# EAGLE design TriggerTrap Shield 0v24 Release (EAGLE 6.2)
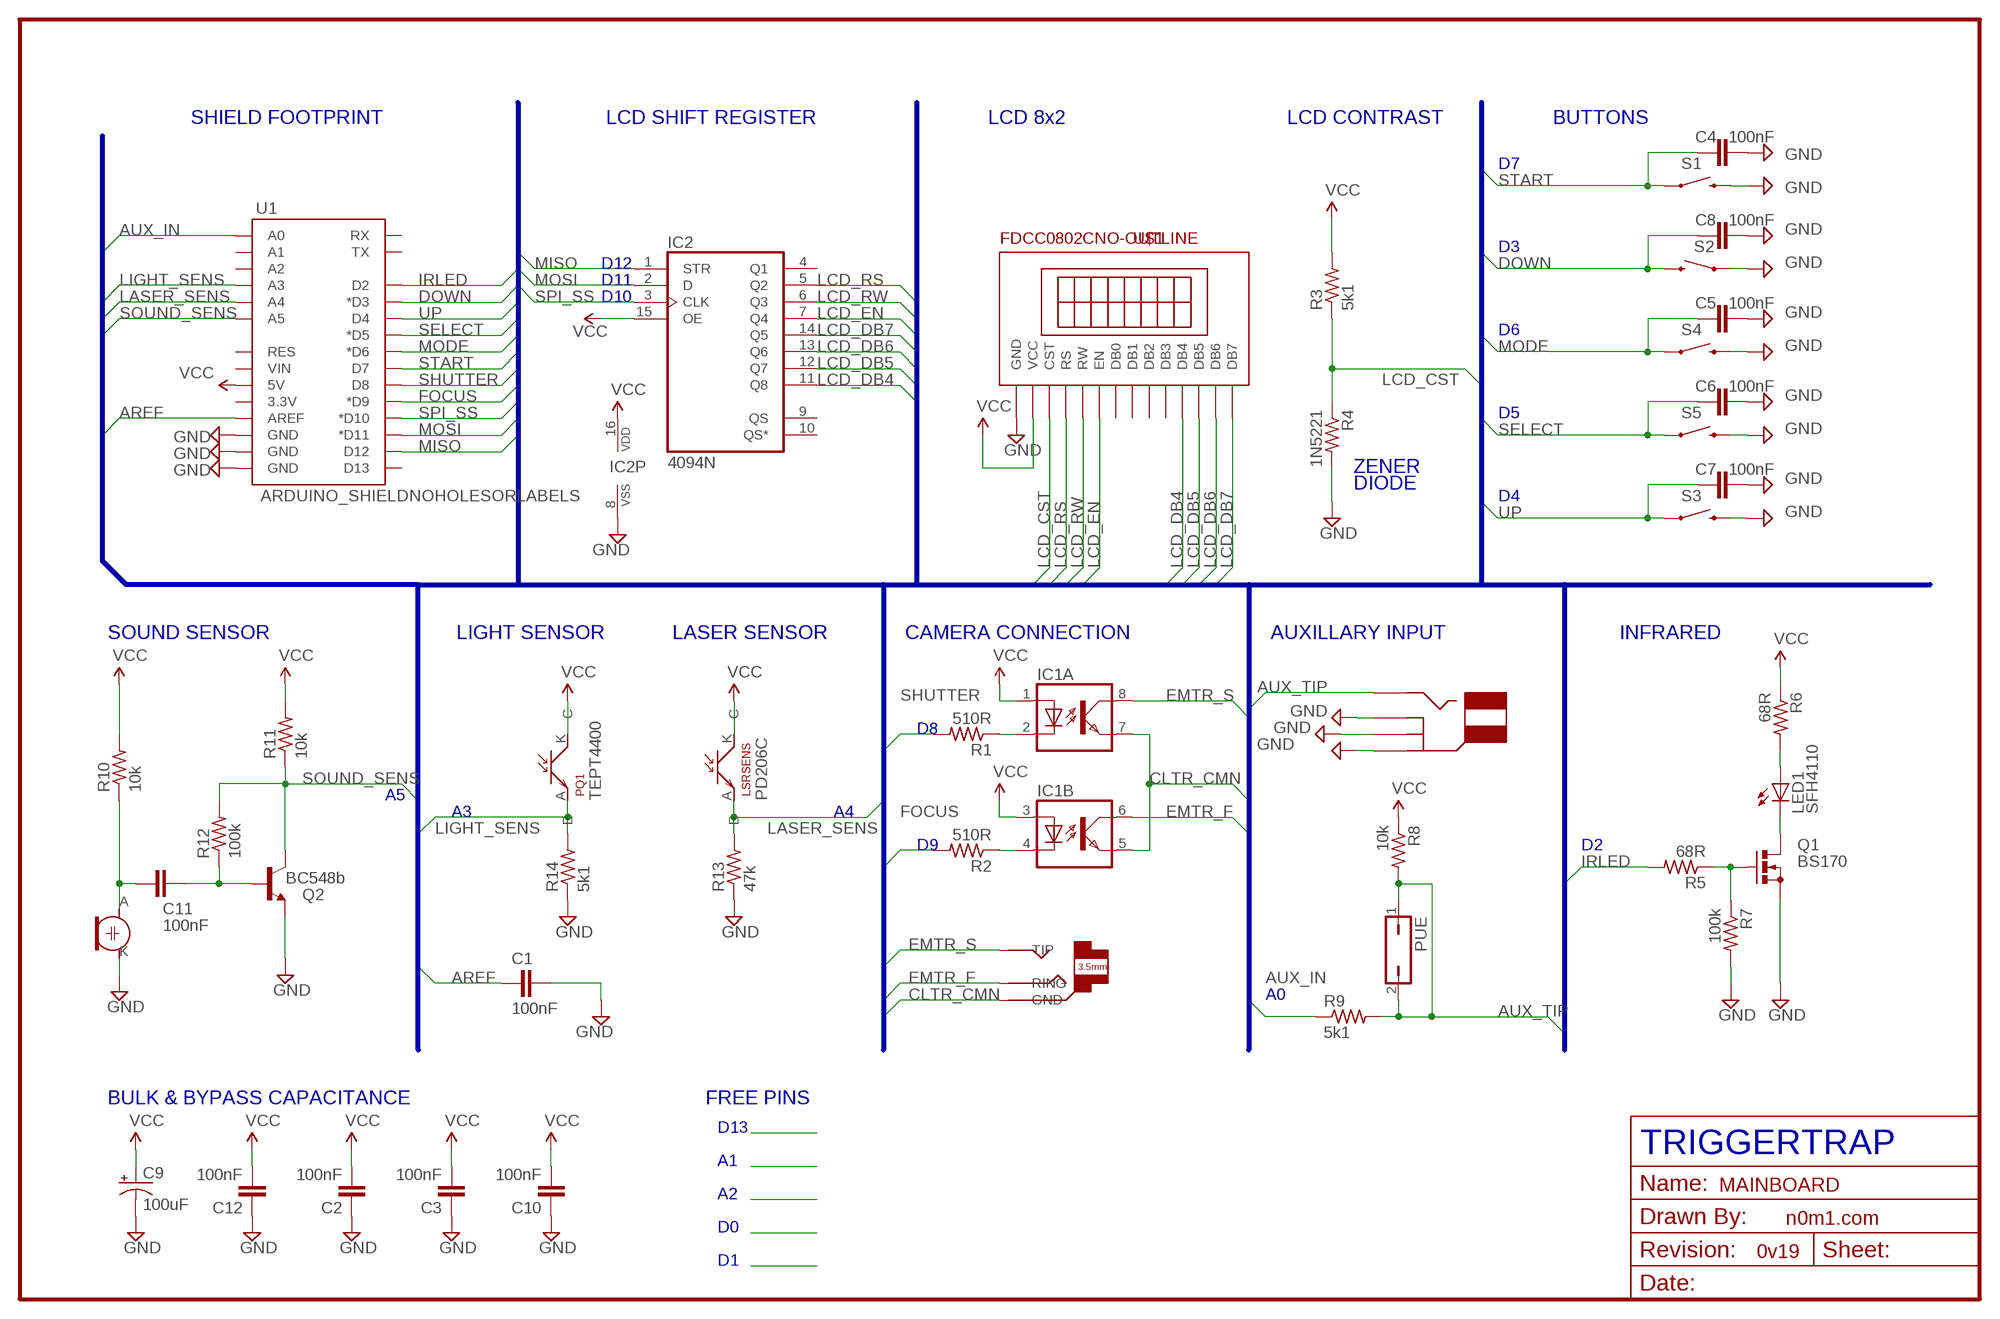
[diagram p0: schematic, sheet 1]

## Parts
AUX  CUI_RCJ-017-RCA  [RCA_CUI_RCJ-017]
C1  100nF  C-EU050-024X044  [C050-024X044]
C2  100nF  C-EU050-024X044  [C050-024X044]
C3  100nF  C-EU050-024X044  [C050-024X044]
C4  100nF  C-EU050-024X044  [C050-024X044]
C5  100nF  C-EU050-024X044  [C050-024X044]
C6  100nF  C-EU050-024X044  [C050-024X044]
C7  100nF  C-EU050-024X044  [C050-024X044]
C8  100nF  C-EU050-024X044  [C050-024X044]
C9  100uF  CPOL-USTT2D7L  [TT2D7L]
C10  100nF  C-EU050-024X044  [C050-024X044]
C11  100nF  C-EU050-024X044  [C050-024X044]
C12  100nF  C-EU050-024X044  [C050-024X044]
CAM  AUDIO_3.5MM_L_3523  [AUDIO_3.5MM_LONG]
IC1  LTV826SMLPADS  [DIL08-SMLPADS]
IC2  4094N  [DIL16]
LED1  SFH4110  LEDSIDE_LED  [SIDE_LED]
LSRSENS  PD204-6C  LASER_SNS3MM  [LSR-SNS-3MM]
MIC  MIC  [MIC-254-ECM94-RO]
PQ1  TEPT4400  AMB-LIGHT-SENS  [LED-3MM]
PUE  JP1Q  [JP1]
Q1  BS170  [SOT54E]
Q2  BC548b  BC55054  [SOT54E]
R1  510R  R-US_0204/5  [0204/5]
R2  510R  R-US_0204/5  [0204/5]
R3  5k1  R-US_0204/5  [0204/5]
R4  1N5221  R-US_0204/5  [0204/5]
R5  68R  R-US_0204/5  [0204/5]
R6  68R  R-US_0204/5  [0204/5]
R7  100k  R-US_0204/5  [0204/5]
R8  10k  R-US_0204/5  [0204/5]
R9  5k1  R-US_0204/5  [0204/5]
R10  10k  R-US_0204/5  [0204/5]
R11  10k  R-US_0204/5  [0204/5]
R12  100k  R-US_0204/5  [0204/5]
R13  47k  R-US_0204/5  [0204/5]
R14  5k1  R-US_0204/5  [0204/5]
S1  SWITCH-MOMENTARY-212MM  [TACTILE-PTH-12MM]
S2  SWITCH-MOMENTARY-2PTH  [TACTILE-PTH]
S3  SWITCH-MOMENTARY-2PTH  [TACTILE-PTH]
S4  SWITCH-MOMENTARY-2PTH  [TACTILE-PTH]
S5  SWITCH-MOMENTARY-2PTH  [TACTILE-PTH]
U1  ARDUINO_SHIELDNOHOLESORLABELS  [DUEMILANOVE_SHIELD_NOHOLES_NOLABELS]
U$1  FDCC0802CNO-OUTLINE  [8X2-TOPLCD-NOOUTLINE]

## Nets
AREF: C1.2 U1.AREF
AUX_IN: R9.1 U1.A0
AUX_TIP: AUX.P$4(TIP) PUE.1 PUE.2 R8.2 R9.2
CLTR_CMN: CAM.P$1(GND) IC1.5(B:EMIT) IC1.7(A:EMIT)
DOWN: C8.1 S2.3 U1.D3(*D3)
EMTR_F: CAM.P$3(RING) IC1.6(B:COL)
EMTR_S: CAM.P$2(TIP) IC1.8(A:COL)
FOCUS: R2.2 U1.D9(*D9)
GND: AUX.P$1(GND1) AUX.P$2(GND2) AUX.P$3(GND) C1.1 C2.1 C3.1 C4.2 C5.2 C6.2 C7.2 C8.2 C9.- C10.1 C12.1 IC2.8(VSS) MIC.K Q1.S Q2.S(E) R4.2 R7.2 R13.1 R14.1 S1.3 S2.1 S3.3 S4.3 S5.3 U1.GND@0(GND) U1.GND@1(GND) U1.GND@2(GND) U$1.P$1(GND)
IRLED: R5.2 U1.D2
LASER_SENS: LSRSENS.A(E) R13.2 U1.A4
LCD_CST: R3.1 R4.1 U$1.P$3(CST)
LCD_DB4: IC2.11(Q8) U$1.P$11(DB4)
LCD_DB5: IC2.12(Q7) U$1.P$12(DB5)
LCD_DB6: IC2.13(Q6) U$1.P$13(DB6)
LCD_DB7: IC2.14(Q5) U$1.P$14(DB7)
LCD_EN: IC2.7(Q4) U$1.P$6(EN)
LCD_RS: IC2.5(Q2) U$1.P$4(RS)
LCD_RW: IC2.6(Q3) U$1.P$5(RW)
LIGHT_SENS: PQ1.A(E) R14.2 U1.A3
MISO: IC2.1(STR) U1.D12
MODE: C5.1 S4.1 U1.D6(*D6)
MOSI: IC2.2(D) U1.D11(*D11)
N$1: C11.1 MIC.A R10.1
N$2: LED1.K(C) Q1.D
N$4: LED1.A R6.2
N$7: Q1.G R5.1 R7.1
N$10: C11.2 Q2.G(B) R12.1
N$11: IC1.4(B:C) R2.1
N$13: IC1.2(A:C) R1.1
SELECT: C6.1 S5.1 U1.D5(*D5)
SHUTTER: R1.2 U1.D8
SOUND_SENS: Q2.D(C) R11.1 R12.2 U1.A5
SPI_SS: IC2.3(CLK) U1.D10(*D10)
START: C4.1 S1.1 U1.D7
UP: C7.1 S3.1 U1.D4
VCC: C2.2 C3.2 C9.+ C10.2 C12.2 IC1.1(A:A) IC1.3(B:A) IC2.15(OE) IC2.16(VDD) LSRSENS.K(C) PQ1.K(C) R3.2 R6.1 R8.1 R10.2 R11.2 U1.5V U$1.P$2(VCC)
Unconnected: IC2.4(Q1) IC2.9(QS) IC2.10(QS*) U1.3.3V U1.A1 U1.A2 U1.D13 U1.RES U1.RX U1.TX U1.VIN U$1.P$7(DB0) U$1.P$8(DB1) U$1.P$9(DB2) U$1.P$10(DB3)

## Buses
B$1

## Notes on the sheet
- SHIELD FOOTPRINT | LCD SHIFT REGISTER | LCD 8x2 | LCD CONTRAST | BUTTONS
- D7
- D3
- D12
- D11
- D10
- D6
- D5
- ZENER
- DIODE
- D4
- SOUND SENSOR | LIGHT SENSOR | LASER SENSOR | CAMERA CONNECTION | AUXILLARY INPUT | INFRARED
- D8
- A5 | TEPT4400 | PD206C
- A3 | A4
- D9 | D2
- A0
- BULK & BYPASS CAPACITANCE | FREE PINS
- D13
- TRIGGERTRAP
- A1
- MAINBOARD
- A2
- n0m1.com
- D0
- 0v19
- D1

## Library data of the parts
AUX = TriggerTrap:CUI_RCJ-017-RCA
C1-C8 C10-C12 = rcl:C-EU: CAPACITOR, European symbol
C9 = rcl:CPOL-US: POLARIZED CAPACITOR, American symbol
CAM = TriggerTrap:AUDIO_3.5MM_L_3523
IC1 = optocoupler:LTV826: OPTO COUPLER Source: LITEON, LTV816.pdf
IC2 = 40xx:4094: 8-stage SHIFT/STORE REGISTER, tri-state
LED1 = led:LED: LED OSRAM: - CHIPLED LG R971, LG N971, LY N971, LG Q971, LY Q971, LO R971, LY R971 LH N974, LH R974 LS Q976, LO Q976, LY Q976 LO Q996 - Hyper CHIPLED LW Q18S LB Q993, LB Q99A, LB R99A - SideLED LS A670, LO A670, LY A670, LG A670, LP A670 LB A673, LV A673, LT A673, LW A673 LH A674 LY A675 LS A676, LA A676, LO A676, LY A676, LW A676 LS A679, LY A679, LG A679 - Hyper Micro SIDELED® LS Y876, LA Y876, LO Y876, LY Y876 LT Y87S - SmartLED LW L88C, LW L88S LB L89C, LB L89S, LG L890 LS L89K, LO L89K, LY L89K LS L896, LA L896, LO L896, LY L896 - TOPLED LS T670, LO T670, LY T670, LG T670, LP T670 LSG T670, LSP T670, LSY T670, LOP T670, LYG T670 LG T671, LOG T671, LSG T671 LB T673, LV T673, LT T673, LW T673 LH T674 LS T676, LA T676, LO T676, LY T676, LB T676, LH T676, LSB T676, LW T676 LB T67C, LV T67C, LT T67C, LS T67K, LO T67K, LY T67K, LW E67C LS E67B, LA E67B, LO E67B, LY E67B, LB E67C, LV E67C, LT E67C LW T67C LS T679, LY T679, LG T679 LS T770, LO T770, LY T770, LG T770, LP T770 LB T773, LV T773, LT T773, LW T773 LH T774 LS E675, LA E675, LY E675, LS T675 LS T776, LA T776, LO T776, LY T776, LB T776 LHGB T686 LT T68C, LB T68C - Hyper Mini TOPLED® LB M676 - Mini TOPLED Santana® LG M470 LS M47K, LO M47K, LY M47K Source: http://www.osram.convergy.de LUXEON: - LUMILED® LXK2-PW12-R00, LXK2-PW12-S00, LXK2-PW14-U00, LXK2-PW14-V00 LXK2-PM12-R00, LXK2-PM12-S00, LXK2-PM14-U00 LXK2-PE12-Q00, LXK2-PE12-R00, LXK2-PE12-S00, LXK2-PE14-T00, LXK2-PE14-U00 LXK2-PB12-K00, LXK2-PB12-L00, LXK2-PB12-M00, LXK2-PB14-N00, LXK2-PB14-P00, LXK2-PB14-Q00 LXK2-PR12-L00, LXK2-PR12-M00, LXK2-PR14-Q00, LXK2-PR14-R00 LXK2-PD12-Q00, LXK2-PD12-R00, LXK2-PD12-S00 LXK2-PH12-R00, LXK2-PH12-S00 LXK2-PL12-P00, LXK2-PL12-Q00, LXK2-PL12-R00 Source: www.luxeon.com KINGBRIGHT: KA-3528ASYC Source: www.kingbright.com
LSRSENS = TriggerTrap:LASER_SNS
MIC = TriggerTrap:MIC
PQ1 = TriggerTrap:AMB-LIGHT-SENS
PUE = jumper:JP1Q: JUMPER
Q1 = transistor-small-signal:BS170: N-CHANNEL MOS FET
Q2 = transistor-npn:BC550*: NPN Transistor
R1-R14 = rcl:R-US_: RESISTOR, American symbol
S1-S5 = SparkFun:SWITCH-MOMENTARY-2
U1 = SparkFun:ARDUINO_SHIELD
U$1 = TriggerTrap:FDCC0802C

## Net classes
0 default: width 0.152 mm, drill 0.3 mm, clearance 0.152 mm
1 power: width 0.254 mm, drill 0.3 mm, clearance 0.152 mm

## Board
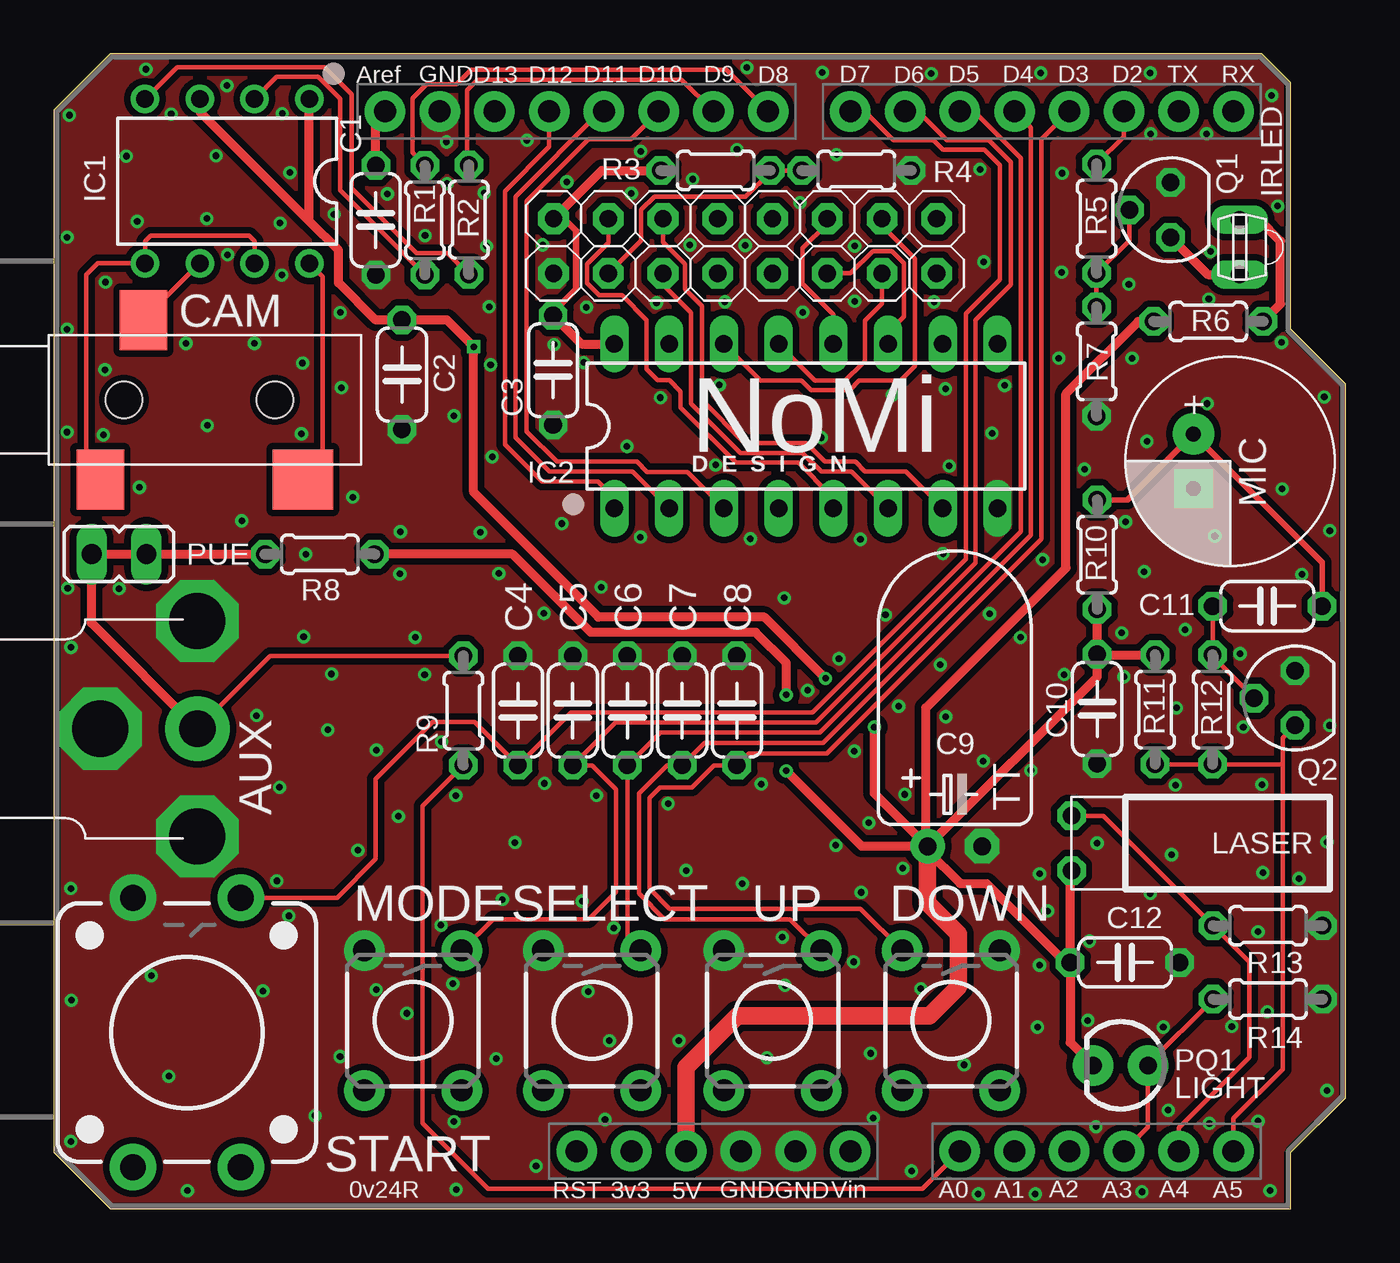
[diagram p1: board, top side]
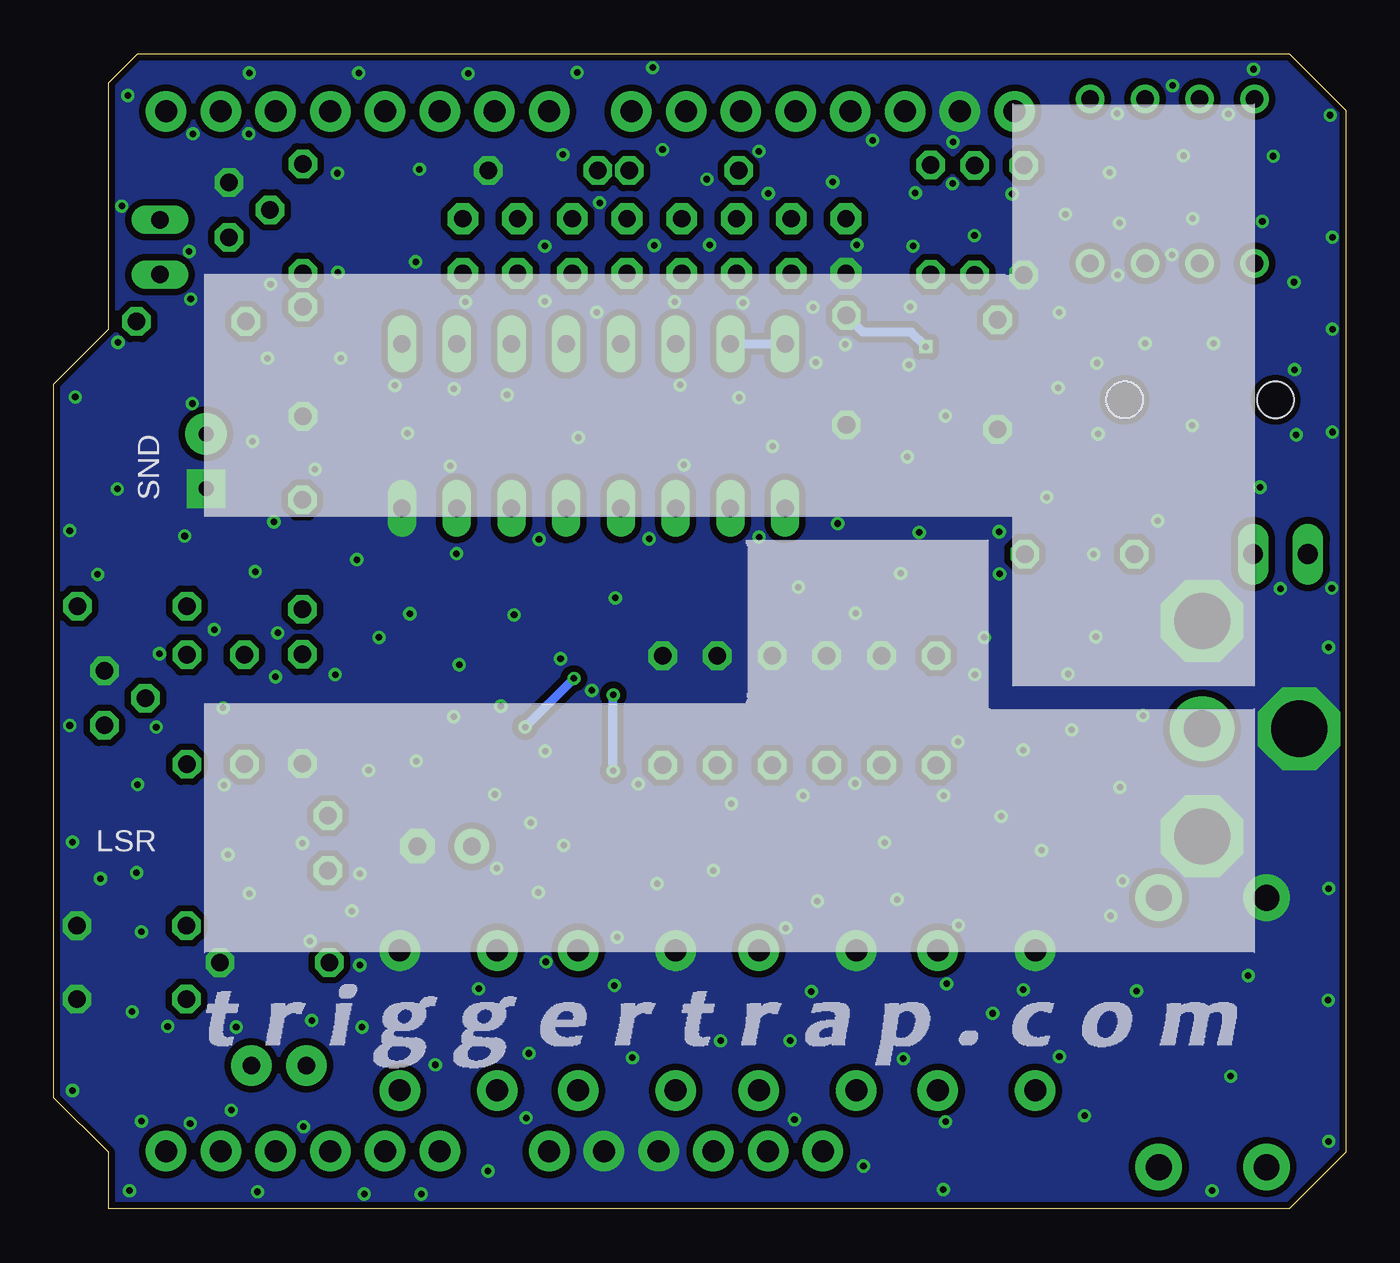
[diagram p2: board, bottom side, seen from below]

Size 59.94 x 53.59 mm. Coordinates in mm from the lower left corner, seen from the top.
Outline: 57.4,0 57.4,2.62 59.94,5.16 59.94,38.28 57.4,40.82 57.4,52.25 56.06,53.59 2.62,53.59 0,50.98 0,2.62 2.62,0 57.4,0
Copper layers (1*16): Top 0.035mm / dielectric 1.5mm / Bottom 0.035mm
Design rules: minimum track width 6mil, minimum drill 0.3mm, track to track 8mil, track to pad 6mil, pad to pad 6mil, via to via 8mil, smd to smd 0mil, copper to edge 10mil, drill to drill 10mil, minimum pad ring 10mil, minimum via ring 6mil, stop-mask expansion 2mil, vias tented up to drill 100mil, thermal gap 10mil

### Footprints (pad centres in the part's own frame; a part is rotated, then mirrored left to right if it is on the bottom)
RCA_CUI_RCJ-017 = drill 2.6 pad 3.81 octagon: P$1 0,0; P$2 -5,-4.5; P$3 5,-4.5 | drill 1.7 pad 3: P$4 0,-4.5
C050-024X044 = drill 0.813 octagon: 1 -2.54,0; 2 2.54,0
TT2D7L = drill 0.813 pad 1.6: + -1.27,0 | drill 0.813 pad 1.6 octagon: - 1.27,0
AUDIO_3.5MM_LONG = smd 2.2 x 2.8: P$1 -4.6,-3.7; P$3 -2.6,3.7 | smd 2.8 x 2.8: P$2 4.8,-3.7 | hole 1.7: -3.5,0; 3.5,0
DIL08-SMLPADS = drill 0.813: 1 -3.81,-3.81; 2 -1.27,-3.81; 3 1.27,-3.81; 4 3.81,-3.81; 5 3.81,3.81; 6 1.27,3.81; 7 -1.27,3.81; 8 -3.81,3.81
DIL16 = drill 0.813 long: 1 -8.89,-3.81; 2 -6.35,-3.81; 3 -3.81,-3.81; 4 -1.27,-3.81; 5 1.27,-3.81; 6 3.81,-3.81; 7 6.35,-3.81; 8 8.89,-3.81; 9 8.89,3.81; 10 6.35,3.81; 11 3.81,3.81; 12 1.27,3.81; 13 -1.27,3.81; 14 -3.81,3.81; 15 -6.35,3.81; 16 -8.89,3.81
SIDE_LED = drill 0.813 long: A 1.27,0; K -1.27,0
LSR-SNS-3MM = drill 0.813 octagon: A -1.27,-7.62; K 1.27,-7.62
MIC-254-ECM94-RO = drill 0.7 pad 1.93: A 1.27,-1.7 | drill 0.7 pad 1.778 square: K -1.27,-1.7
LED-3MM = drill 0.813 pad 1.88: A -1.27,0; K 1.27,0
JP1 = drill 0.914 long: 1 0,-1.27; 2 0,1.27
SOT54E = drill 0.813 octagon: D -1.27,0; G 0,1.905; S 1.27,0
0204/5 = drill 0.813 octagon: 1 -2.54,0; 2 2.54,0
TACTILE-PTH-12MM = drill 1.2 pad 2.159: 1 6.25,-2.5; 2 -6.25,-2.5; 3 6.25,2.5; 4 -6.25,2.5
TACTILE-PTH = drill 1.016 pad 1.88: 1 -3.251,2.261; 2 3.251,2.261; 3 -3.251,-2.261; 4 3.251,-2.261
DUEMILANOVE_SHIELD_NOHOLES_NOLABELS = drill 1.016 pad 1.88: 3.3V 50.8,26.67; 5V 50.8,29.21; A0 50.8,41.91; A1 50.8,44.45; A2 50.8,46.99; A3 50.8,49.53; A4 50.8,52.07; A5 50.8,54.61; AREF 2.54,15.24; D2 2.54,49.53; D3 2.54,46.99; D4 2.54,44.45; D5 2.54,41.91; D6 2.54,39.37; D7 2.54,36.83; D8 2.54,33.02; D9 2.54,30.48; D10 2.54,27.94; D11 2.54,25.4; D12 2.54,22.86; D13 2.54,20.32; GND@0 50.8,31.75; GND@1 50.8,34.29; GND@2 2.54,17.78; RES 50.8,24.13; RX 2.54,54.61; TX 2.54,52.07; VIN 50.8,36.83
8X2-TOPLCD-NOOUTLINE = drill 0.8 pad 1.422 octagon: P$1 -7.62,-1.27; P$2 -7.62,1.27; P$3 -5.08,-1.27; P$4 -5.08,1.27; P$5 -2.54,-1.27; P$6 -2.54,1.27; P$7 0,-1.27; P$8 0,1.27; P$9 2.54,-1.27; P$10 2.54,1.27; P$11 5.08,-1.27; P$12 5.08,1.27; P$13 7.62,-1.27; P$14 7.62,1.27; P$15 10.16,-1.27; P$16 10.16,1.27

### Placement (x,y rotation side)
AUX  2.16,22.28 90 top
C1  14.94,45.87 90 top
C2  16.15,38.71 90 top
C3  23.16,38.91 90 top
C4  21.54,23.11 90 top
C5  24.08,23.11 90 top
C6  26.62,23.11 90 top
C7  29.16,23.11 90 top
C8  31.7,23.11 90 top
C9  41.81,16.81 0 top
C10  48.41,23.19 90 top
C11  56.31,27.97 180 top
C12  49.71,11.43 180 top
CAM  6.76,37.54 0 top
IC1  8.04,47.69 180 top
IC2  34.9,36.32 0 top
LED1  55.03,44.62 90 top
LSRSENS  54.84,16.97 270 top
MIC  54.58,34.69 90 bottom
PQ1  49.5,6.65 180 top
PUE  3.02,30.38 90 top
Q1  51.82,46.36 90 top
Q2  57.61,23.7 90 top
R1  17.22,45.87 90 top
R2  19.25,45.9 90 top
R3  30.71,48.18 180 top
R4  37.24,48.18 0 top
R5  48.39,45.95 90 top
R6  53.57,41.17 0 top
R7  48.39,39.32 270 top
R8  12.34,30.38 180 top
R9  19,23.11 90 top
R10  48.41,30.35 270 top
R11  51.1,23.16 90 top
R12  53.77,23.16 270 top
R13  56.34,13.13 180 top
R14  56.34,9.73 180 top
S1  6.17,8.18 90 top
S2  41.63,8.74 270 top
S3  33.35,8.74 270 top
S4  16.66,8.74 270 top
S5  24.97,8.74 270 top
U1  0.13,53.47 270 top
U$1  30.81,44.68 0 top

### Tracks (layer width: path | path; a pad name or v marks a point on that pad's centre or on a via)
AREF
  Top 0.406: C1.2 14.94,50.5 U1.AREF
AUX_IN
  Top 0.203: U1.A0 40.31,0.94 20.15,0.94 17.12,3.96 17.12,18.69 R9.1
AUX_TIP
  Top 0.203: R9.2 10.04,25.65 AUX.P$4
  Top 0.406: AUX.P$4 1.75,27.18 1.75,30.25 | R8.2 PUE.1 1.88,30.38 1.75,30.25 | 1.75,30.25 PUE.2
CLTR_CMN
  Top 0.203: IC1.7 9.32,43.88 9.32,44.91 9.07,45.16 4.49,45.16 4.23,44.91 IC1.5 2.04,43.88 1.5,43.34 1.5,34.63 1.51,34.47 | CAM.P$1 1.51,34.47 | 1.51,34.47 1.42,34.58
DOWN
  Top 0.203: U1.D3 45.82,49.63 45.82,31.08 35.88,21.13 32.26,21.13 C8.1 31.5,20.57 31.37,20.57 30.63,20.57 29.62,19.56 28.14,19.56 27.64,19.05 27.64,14.86 28.57,13.92 37.44,13.92 S2.3
EMTR_F
  Top 0.203: CAM.P$3 4.16,41.26 IC1.6
EMTR_S
  Top 0.203: IC1.8 12.47,43.26 12.47,33.71 12.46,33.71 CAM.P$2
FOCUS
  Top 0.203: U1.D9 29.13,52.4 19.66,52.4 19.18,51.92 19.18,48.51 R2.2
GND  (via drill 0.3)
  other vias: 41.38,38.05 10.6,50.83 16.08,31.42 18.57,36.8 11.69,30.37 11.48,35.96 13.29,41.59 23.57,31.8 8.03,52.12 5.44,50.8 0.72,50.75 0.62,45.09 3.87,45.82 7.09,45.95 10.5,45.75 10.95,48.08 7.53,48.87 17.23,45.16 18.22,49.5 21.95,49.58 19.97,47.14 20.07,44.68 20.2,41.86 10.57,43.33 9.3,40.16 6.13,40.16 0.62,40.82 2.37,38.94 2.29,35.92 13.34,38.1 7.12,36.35 8.72,31.93 3.97,33.48 14.1,16.64 0.79,26.06 12.88,24.82 14.97,21.29 9.41,22.89 3.03,28.78 12.71,22.23 11.59,26.54 16.77,26.52 17.2,24.79 15.98,18.21 10.34,15.21 10.47,19.56 41.26,30.4 37.43,31.06 32.32,31.09 27.22,31.17 13,46.15 41.14,25.25 37.15,21.23 41.39,22.83 46.11,13.82 36.29,16.87 29.34,15.7 37.46,14.68 16.38,9.07 20.52,6.96 25.78,7.8 29.01,7.8 33.1,7.01 37.9,7.21 40.23,10.21 37.11,11.46 18.52,10.44 14.96,10.16 13.28,7.06 18.57,4.04 22.38,1.98 25.58,4.14 18.67,0.89 0.79,14.86 0.81,9.68 0.79,3.12 6.2,0.84 4.52,10.82 5.33,6.15 9.7,10.11 12.12,4.32 10.9,13.59 38.02,4.22 39.8,1.75 42.9,0.69 42.24,6.68 45.54,0.69 50.5,0.79 56.44,0.84 55.88,4.06 53.62,3.96 51.71,4.57 56.31,9.14 54.66,8.46 51.49,8.43 59.08,5.49 57.78,15.32 59.08,17.02 59.21,22.43 56.06,19.69 56.11,15.6 55.88,12.85 51.87,16.43 52.04,19.66 48.41,16.97 48.06,12.42 50.88,14.63 46.89,24.79 45.34,20.35 43.13,20.78 45.75,15.54 52.1,23.24 55.19,22.35 55.04,25.76 52.5,26.87 57.91,29.44 49.73,31.88 44.86,26.52 53.87,31.22 58.95,37.67 57,33.4 53.52,37.36 50.04,39.47 47.83,34.32 50.72,35.61 56.97,40.21 53.67,44.42 49.89,42.9 46.76,43.46 46.79,48.06 50.9,49.89 53.49,49.89 56.52,51.66 50.88,52.7 45.8,52.7 40.72,52.68 35.66,52.73 42.98,48.23 40.84,42.09 43.15,43.94 37.16,44.68 36.32,48.92 34.75,41.61 31.14,42.09 29.51,44.73 32.08,44.7 34.62,46.69 31.7,49.15 29.64,47.78 23.8,47.65 27.23,49.07 26.8,47.12 24.71,41.83 27.97,42.04 22.68,44.73 23.22,40.11 28.14,37.64 26.59,35.38 30.71,34.52 30.89,38.23 35.61,35.79 38.91,37.77 41.55,34.47 44.12,38.2 43.54,35.99 17.96,13.16 24.52,14.27 39.49,19.23 19.79,31.39 37.16,42.11 2.39,43 8.06,44.27 39.21,23.32 46.63,39.47 45.89,30.12 43.42,27.61 49.56,26.72 11.54,39.24 20.81,14.35 25.18,19.18 25.98,13.03 24.79,10.08 33.81,12.6 31.95,15.09 33.93,10.36 39.4,15.8 45.75,11.3 45.64,8.43 48.36,3.81 24.59,39.27 20.27,39.16 20.34,34.9 20.65,29.49 32.16,52.96 53.59,42.21 56.79,46.53 47.98,8.74 22.77,19.74 18.65,19.18 21.39,16.99 28.51,18.8 32.82,19.71 17.99,21.67 34.98,24.05 38.59,27.56 33.89,28.35 22.74,27.64 36.43,25.53 25.4,28.85 13.87,33.02 49.66,24.69 37.82,17.91 4.27,52.88 3.36,48.84 15.48,47.09 16.05,29.46 0.62,36.04 0.64,28.8 50.6,29.57 59.21,31.47 18.24,47.57
  pour Top (isolate 0.305, no thermals): 0.13,50.93 0.13,2.67 2.67,0.13 57.28,0.13 57.28,2.67 59.82,5.21 59.82,38.23 57.28,40.77 57.28,52.2 56.01,53.47 2.67,53.47
  pour Bottom (isolate 0.305, no thermals): 0.13,50.93 0.13,2.67 2.67,0.13 57.28,0.13 57.28,2.67 59.82,5.21 59.82,38.23 57.28,40.77 57.28,52.2 56.01,53.47 2.67,53.47
IRLED
  Top 0.203: U1.D2 49.66,49.76 R5.2
LASER_SENS
  Top 0.203: U1.A4 52.2,3.76 55.47,7.04 55.47,11.46 R13.2 48.69,18.24 LSRSENS.A
LCD_CST
  Top 0.203: R4.1 R3.1 33.25,48.11 32.11,46.96 27.86,46.96 27.25,46.35 27.25,44.93 U$1.P$3
LCD_DB4
  Top 0.203: U$1.P$11 36.96,43.41 38,44.45 38.89,44.45 39.45,43.89 39.45,41.4 38.71,40.67 IC2.11
LCD_DB5
  Top 0.203: U$1.P$12 35.89,45.72 34.75,44.58 34.75,42.93 36.17,41.5 IC2.12
LCD_DB6
  Top 0.203: IC2.13 35.33,38.43 36.72,38.43 37.52,39.23 37.64,39.34 37.64,41.22 38.43,42.01 U$1.P$13
LCD_DB7
  Top 0.203: U$1.P$14 38.43,45.62 39.95,44.09 39.95,39.1 39.29,38.43 37.36,38.43 36.93,38 35.13,38 34.7,38.43 32.79,38.43 IC2.14
LCD_EN
  Top 0.203: IC2.7 39.55,34.21 37.64,34.21 37.19,34.67 35.79,34.67 34.92,35.53 32.05,35.53 30.07,37.52 30.07,41.88 29.29,42.67 29.29,43.84 28.27,44.86 U$1.P$6
LCD_RS
  Top 0.203: IC2.5 36.07,32.61 36.07,33.1 34.54,34.62 31.65,34.62 29.08,37.19 29.08,37.93 28.56,38.46 28.02,38.46 27.51,38.96 27.51,41.25 26.37,42.39 25.3,42.39 24.74,42.95 24.74,43.84 25.73,44.83 U$1.P$4
LCD_RW
  Top 0.203: U$1.P$5 28.27,42.88 29.57,41.58 29.57,37.36 31.85,35.08 34.75,35.08 35.61,34.21 37.01,34.21 IC2.6
LIGHT_SENS
  Top 0.203: R14.2 50.77,6.71 PQ1.A 50.77,3.78 U1.A3
MISO
  Top 0.203: IC2.1 26.01,32.99 25.25,33.76 22.65,33.76 20.93,35.47 20.93,47.22 22.99,49.28 U1.D12
MODE
  Top 0.203: U1.D6 40.11,50.93 41.45,49.58 43.38,49.58 44.4,48.56 44.4,42.88 42.77,41.25 42.77,29.97 35.36,22.56 26.06,22.56 C5.1 24.97,20.57 26.09,19.46 26.09,14.71 24.82,13.44 20.37,13.44 S4.1
MOSI
  Top 0.203: U1.D11 25.37,50.93 21.42,46.98 21.42,35.8 23.01,34.21 26.85,34.21 IC2.2
N$1
  Top 0.254: R10.1 49.82,32.89 MIC.A 58.85,29.99 C11.1
N$2
  Top 0.406: LED1.K 53.55,43.35 Q1.D
N$4
  Top 0.406: LED1.A 55.26,45.9 55.93,45.9 56.92,44.91 56.92,41.99 R6.2
N$7
  Top 0.203: R7.1 R5.1 49.91,44.93 Q1.G
N$10
  Top 0.203: C11.2 R12.1 53.77,25.63 Q2.G
N$11
  Top 0.203: IC1.4 5.72,52.98 12.56,52.98 13.82,51.73 13.82,47.37 16.84,44.35 18.26,44.35 R2.1
N$13
  Top 0.203: IC1.2 10.34,52.53 12.27,52.53 13.28,51.51 13.28,47.27 R1.1
SELECT
  Top 0.203: U1.D5 42.7,50.93 44.88,48.74 44.88,31.43 35.55,22.1 28.14,22.1 C6.1 26.62,12.6 S5.1
SHUTTER
  Top 0.203: U1.D8 31.22,52.86 19.35,52.86 18.69,52.2 17.3,52.2 16.64,51.54 16.64,49 R1.2
SOUND_SENS
  Top 0.203: U1.A5 54.74,4.19 57.02,6.48 57.02,20.62 | R11.1 R12.2 57.02,20.62 | 57.02,20.62 57.02,21.84 Q2.D
SPI_SS
  Top 0.203: IC2.3 29.41,34.19 27.53,34.19 27.05,34.67 23.34,34.67 21.94,36.08 21.94,46.76 24.81,49.63 26.77,49.63 U1.D10
START
  Top 0.203: U1.D7 37.62,50.93 38.96,49.58 40.82,49.58 41.25,49.15 43.18,49.15 43.91,48.42 43.91,43.12 42.32,41.53 42.32,30.16 35.19,23.04 24,23.04 C4.1 19.53,22.58 17.58,22.58 14.94,19.94 14.94,16.23 13.13,14.43 S1.1
UP
  Top 0.203: U1.D4 45.34,50.16 45.34,31.27 35.69,21.62 30.2,21.62 C7.1 28.45,20.57 27.15,19.28 27.15,14.63 28.35,13.44 34.16,13.44 S3.1
VCC  (via drill 0.3)
  Top 0.305: U$1.P$2 23.67,45.95 24.23,45.39 24.23,42.67 23.19,41.63 C3.2
  Top 0.406: R3.2 25.43,48.18 U$1.P$2 | LSRSENS.K 47.17,15.65 C12.2 | R11.2 48.44,25.7 C10.2 | C10.2 R10.2 | 6.77,51.16 IC1.3 6.77,50.91 11.85,45.83 | PQ1.K 47.17,7.72 C12.2 | C3.2 24.49,40.13 IC2.16 | R6.1 50.32,41.17 46.96,37.82 46.96,29.74 40.46,23.24 40.46,16.89 C9.+ | C12.2 46.94,11.43 43.28,15.09 42.06,15.09 40.54,16.61 40.54,16.66 | v33.99,23.85 33.99,25.32 32.56,26.75 24.92,26.75 21.29,30.38 R8.1 | v35.81,24.61 32.97,27.46 25.27,27.46 19.48,33.25 v19.48,40 18.24,41.25 C2.2 14.94,41.25 13.21,42.98 13.21,44.48 11.85,45.83 | v38.07,22.35 38.07,19.28 C9.+ | C10.2 48.41,24.69 C9.+ | v33.99,20.32 37.49,16.81 C9.+ | 11.85,45.83 IC1.1
  Top 0.813: U1.5V 29.34,6.55 31.72,8.94 40.64,8.94 41.99,10.29 41.99,12.75 40.54,14.2 40.54,16.66 C9.+
  Bottom 0.406: v19.48,40 20.17,40.69 22.4,40.69 C3.2 | IC2.16 IC2.15 | v33.99,20.32 v33.99,23.85 | v38.07,22.35 v35.81,24.61

### Text on the board
tPlace: IRLED | CAM | AUX | LASER | MODE | SELECT | UP | DOWN | LIGHT | START
bPlace: SND | LSR
tNames: Aref | GND | D13 | D12 | D11 | D10 | D9 | D8 | D7 | D6 | D5 | D4 | D3 | D2 | TX | RX | NoMi | D E S I G N | 0v24R | RST | 3v3 | 5V | GND | GND | Vin | A0 | A1 | A2 | A3 | A4 | A5